# Altium schematic sheet LedMatrix.SchDoc
size A4; Organization: Altium Limited; Address1: L3, 12a Rodborough Rd; Address2: Frenchs Forest; Address3: NSW; Address4: Australia 2086
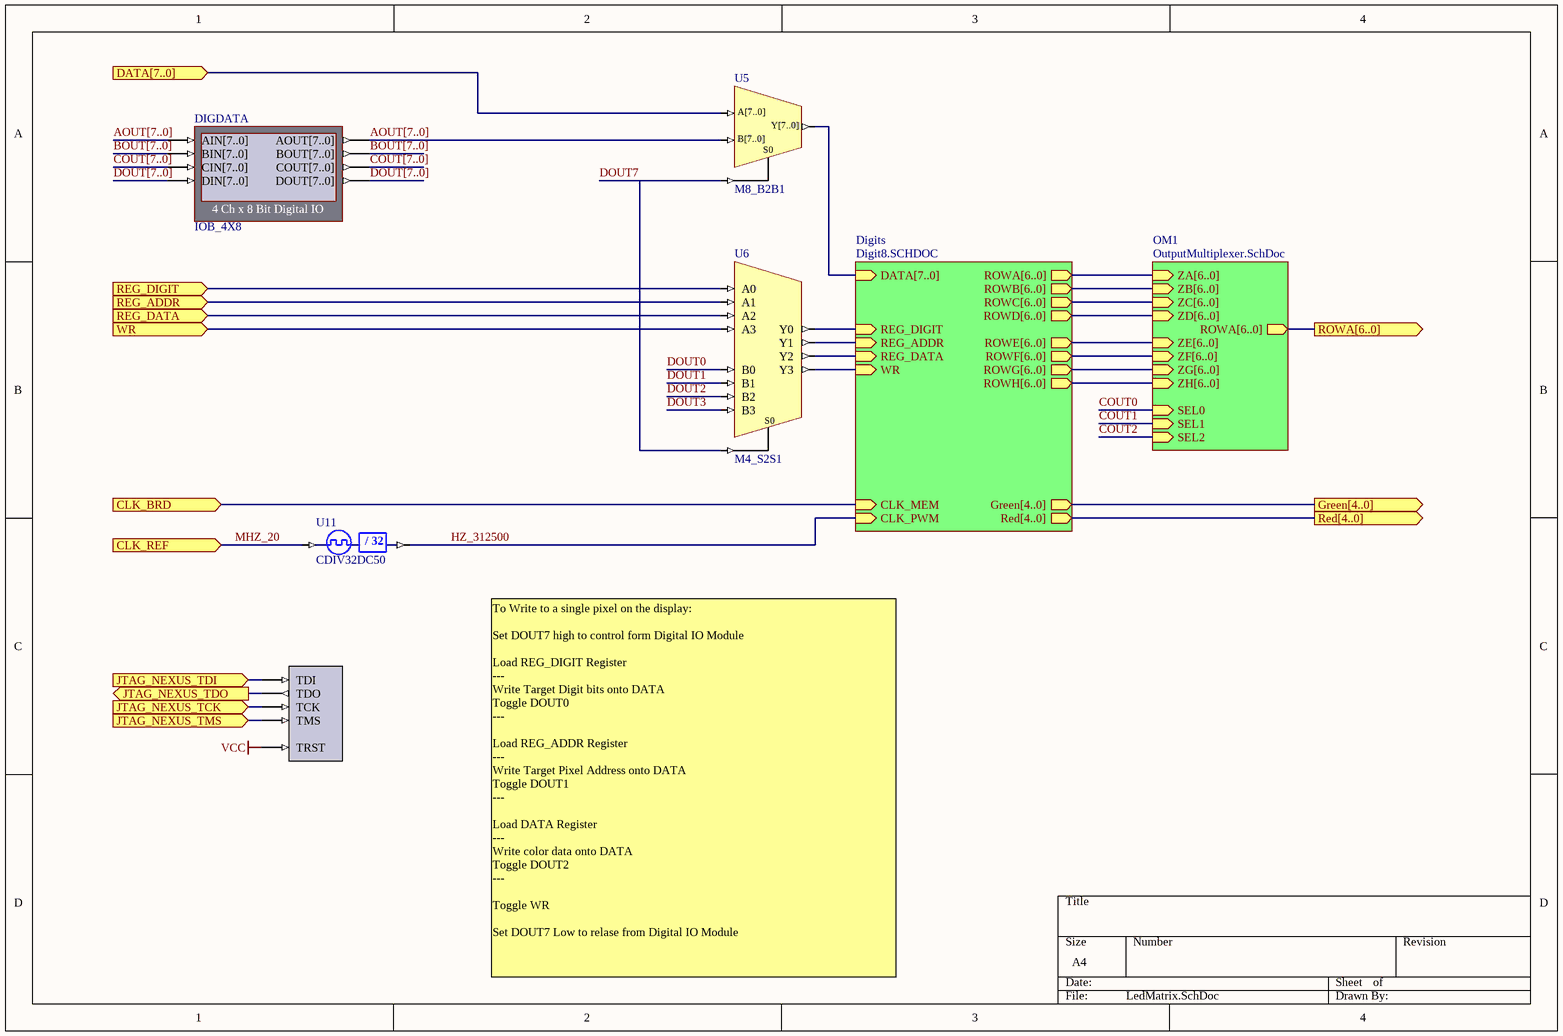
[diagram p0: LedMatrix.SchDoc]

## Parts
DIGDATA  IOB_4X8
NEXUS_JTAG_PORT1  NEXUS_JTAG_PORT  (value not drawn)
U5  M8_B2B1
U6  M4_S2S1
U11  CDIV32DC50

## Sub-sheets
Digits = Digit8.SCHDOC: ROWB[6..0] (out), ROWC[6..0] (out), ROWD[6..0] (out), ROWF[6..0] (out), ROWG[6..0] (out), ROWH[6..0] (out), ROWE[6..0] (out), ROWA[6..0] (out), CLK_MEM (in), CLK_PWM (in), DATA[7..0] (in), Red[4..0] (out), Green[4..0] (out), REG_DIGIT (in), REG_ADDR (in), REG_DATA (in), WR (in)
OM1 = OutputMultiplexer.SchDoc: ROWA[6..0] (out), SEL0 (in), SEL1 (in), SEL2 (in), ZB[6..0] (in), ZC[6..0] (in), ZD[6..0] (in), ZF[6..0] (in), ZG[6..0] (in), ZH[6..0] (in), ZE[6..0] (in), ZA[6..0] (in)

## Ports
CLK_BRD (in), CLK_REF (in), DATA[7..0] (in), Green[4..0] (out), JTAG_NEXUS_TCK (in), JTAG_NEXUS_TDI (in), JTAG_NEXUS_TDO (out), JTAG_NEXUS_TMS (in), Red[4..0] (out), REG_ADDR (in), REG_DATA (in), REG_DIGIT (in), ROWA[6..0] (out), WR (in)

## Nets
VCC: NEXUS_JTAG_PORT1.TRST
AOUT[7..0]: DIGDATA.AIN[7..0] DIGDATA.AOUT[7..0] U5.B[7..0]
BOUT[7..0]: DIGDATA.BIN[7..0] DIGDATA.BOUT[7..0]
CLK_BRD: port CLK_BRD, sheet Digits/CLK_MEM
COUT0: sheet OM1/SEL0
COUT1: sheet OM1/SEL1
COUT2: sheet OM1/SEL2
COUT[7..0]: DIGDATA.CIN[7..0] DIGDATA.COUT[7..0]
DATA[7..0]: U5.A[7..0] ; port DATA[7..0]
DOUT0: U6.B0
DOUT1: U6.B1
DOUT2: U6.B2
DOUT3: U6.B3
DOUT7: U5.S0 U6.S0
DOUT[7..0]: DIGDATA.DIN[7..0] DIGDATA.DOUT[7..0]
HZ_312500: U11.CLKDV ; sheet Digits/CLK_PWM
JTAG_NEXUS_TCK: NEXUS_JTAG_PORT1.TCK ; port JTAG_NEXUS_TCK
JTAG_NEXUS_TDI: NEXUS_JTAG_PORT1.TDI ; port JTAG_NEXUS_TDI
JTAG_NEXUS_TDO: NEXUS_JTAG_PORT1.TDO ; port JTAG_NEXUS_TDO
JTAG_NEXUS_TMS: NEXUS_JTAG_PORT1.TMS ; port JTAG_NEXUS_TMS
MHZ_20: U11.CLKIN ; port CLK_REF
REG_ADDR: U6.A1 ; port REG_ADDR
REG_DATA: U6.A2 ; port REG_DATA
REG_DIGIT: U6.A0 ; port REG_DIGIT
WR: U6.A3 ; port WR
NetU5_Y[7..0]: U5.Y[7..0] ; sheet Digits/DATA[7..0]
NetU6_Y0: U6.Y0 ; sheet Digits/REG_DIGIT
NetU6_Y1: U6.Y1 ; sheet Digits/REG_ADDR
NetU6_Y2: U6.Y2 ; sheet Digits/REG_DATA
NetU6_Y3: U6.Y3 ; sheet Digits/WR

## Buses and harness runs
bus AOUT[7..0]
bus BOUT[7..0]
bus COUT[7..0]
bus DOUT[7..0]
bus port Green[4..0] = sheet Digits/Green[4..0]
bus port Red[4..0] = sheet Digits/Red[4..0]
bus port ROWA[6..0] = sheet OM1/ROWA[6..0]
bus sheet Digits/ROWA[6..0] = sheet OM1/ZA[6..0]
bus sheet Digits/ROWB[6..0] = sheet OM1/ZB[6..0]
bus sheet Digits/ROWC[6..0] = sheet OM1/ZC[6..0]
bus sheet Digits/ROWD[6..0] = sheet OM1/ZD[6..0]
bus sheet Digits/ROWE[6..0] = sheet OM1/ZE[6..0]
bus sheet Digits/ROWF[6..0] = sheet OM1/ZF[6..0]
bus sheet Digits/ROWG[6..0] = sheet OM1/ZG[6..0]
bus sheet Digits/ROWH[6..0] = sheet OM1/ZH[6..0]

## Notes on the sheet
- To Write to a single pixel on the display:
  Set DOUT7 high to control form Digital IO Module
  Load REG_DIGIT Register
  ---
  Write Target Digit bits onto DATA
  Toggle DOUT0
  ---
  Load REG_ADDR Register
  ---
  Write Target Pixel Address onto DATA
  Toggle DOUT1
  ---
  Load DATA Register
  ---
  Write color data onto DATA
  Toggle DOUT2
  ---
  Toggle WR
  Set DOUT7 Low to relase from Digital IO Module
- Title
- Size:
- Date:
- A4
- Number:
- Time:
- Revision:
- Sheet
- of
- File:
- (in symbol CDIV32DC50) / 32

## Library data of the parts
DIGDATA = IOB_4X8: 4 Ch x 8 Bit Digital IO; NEXUS_CORE: Instrument; NEXUS_JTAG_DEVICE: True; NEXUS_JTAG_ORDER: 0; Published: 30/09/2003; Publisher: Altium Hobart Technology Centre; Core Revision: 1.00.00
NEXUS_JTAG_PORT1 = NEXUS_JTAG_PORT: Nexus Processor JTAG Chain Connector; NEXUS_JTAG_CONNECTOR: True; Published: 5-Sep-2003; Publisher: Altium Hobart Technology Centre
U5 = M8_B2B1: 2x8-Bit Bus to 1x8-Bit Bus Multiplexer; ArchiveName: GENERIC; Published: 18-Nov-2003; Publisher: Altium Limited; Core Revision: 1.00.00
U6 = M4_S2S1: 2x4-Single Wire to 1x4-Single Wire Multiplexer; ArchiveName: GENERIC; Published: 18-Nov-2003; Publisher: Altium Limited; Core Revision: 1.00.00
U11 = CDIV32DC50: Clock Divider by 32 with 50% Duty Cycle Output; ArchiveName: GENERIC; Publisher: Altium Limited; Core Revision: 1.00.00